# Altium schematic sheet Magnetometer_Analog.SchDoc
size Tabloid
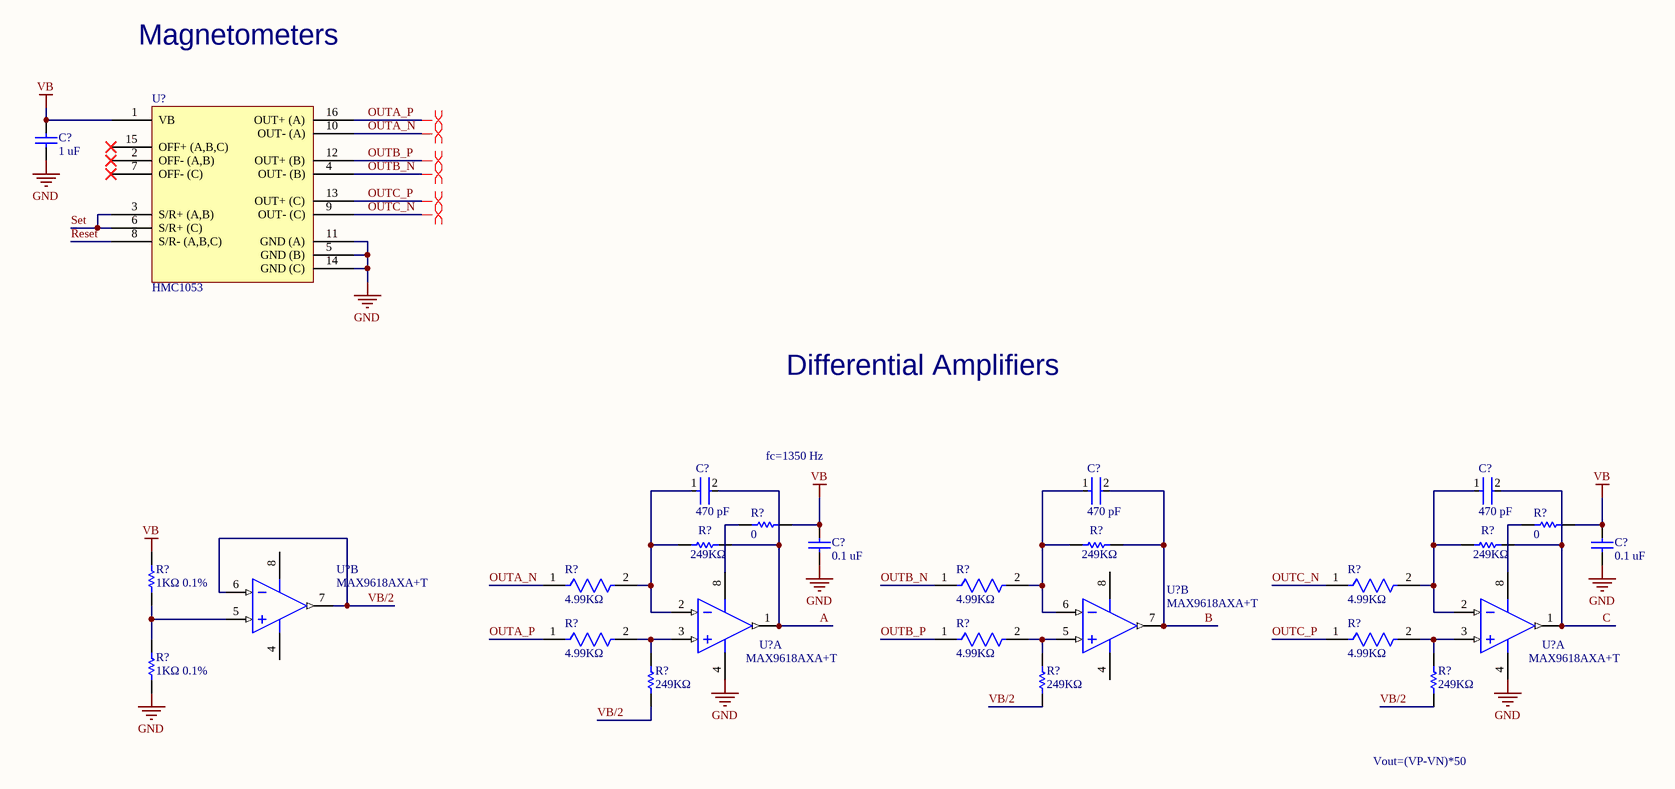
[diagram p0: Magnetometer_Analog.SchDoc]

## Parts
(Parts that share a designator on the sheet are numbered #1, #2 ... from top to bottom, then left to right.)
C?#1  1 uF  [CAPC1608X90X20ML10]
C?#2  470 pF  [FP-C0603C-CF-MFG]
C?#3  470 pF  [FP-C0603C-CF-MFG]
C?#4  470 pF  [FP-C0603C-CF-MFG]
C?#5  0.1 uF  [CAPC1608X87X35NL15T15]
C?#6  0.1 uF  [CAPC1608X87X35NL15T15]
R?#1  0  [RESC1608X55X25NL10T15]
R?#2  0  [RESC1608X55X25NL10T15]
R?#3  249KΩ  [RESC1609X55X30NL10T20]
R?#4  249KΩ  [RESC1609X55X30NL10T20]
R?#5  249KΩ  [RESC1609X55X30NL10T20]
R?#6  4.99KΩ  [FP-RT0603-MFG]
R?#7  4.99KΩ  [FP-RT0603-IPC_B]
R?#8  4.99KΩ  [FP-RT0603-IPC_B]
R?#9  1KΩ 0.1%  [RESC1608X55X30LL20T20]
R?#10  4.99KΩ  [FP-RT0603-IPC_B]
R?#11  4.99KΩ  [FP-RT0603-IPC_B]
R?#12  4.99KΩ  [FP-RT0603-IPC_B]
R?#13  1KΩ 0.1%  [RESC1608X55X30LL20T20]
R?#14  249KΩ  [RESC1609X55X30NL10T20]
R?#15  249KΩ  [RESC1609X55X30NL10T20]
R?#16  249KΩ  [RESC1609X55X30NL10T20]
U?#1  HMC1053  [LCC16]
U?#2  MAX9618AXA+T  [X8CN+1_L]  (part B of 2)
U?#3  MAX9618AXA+T  [X8CN+1_L]  (part A of 2)
U?#4  MAX9618AXA+T  [X8CN+1_L]  (part B of 2)
U?#5  MAX9618AXA+T  [X8CN+1_L]  (part A of 2)

## Nets
GND: C?#1.2 C?#5.1 C?#6.1 R?#13.1 U?#1.5(GND_(B)) U?#1.11(GND_(A)) U?#1.14(GND_(C)) U?#3.4(GND) U?#5.4(GND)
VB: C?#1.1 C?#5.2 C?#6.2 R?#1.2 R?#2.2 R?#9.2 U?#1.1(VB)
A: C?#2.2 R?#3.2 U?#3.1(OUT)
B: C?#3.2 R?#4.2 U?#4.7(OUT)
C: C?#4.2 R?#5.2 U?#5.1(OUT)
OUTA_N: R?#6.1 U?#1.10(OUT-_(A))
OUTA_P: R?#10.1 U?#1.16(OUT+_(A))
OUTB_N: R?#7.1 U?#1.4(OUT-_(B))
OUTB_P: R?#11.1 U?#1.12(OUT+_(B))
OUTC_N: R?#8.1 U?#1.9(OUT-_(C))
OUTC_P: R?#12.1 U?#1.13(OUT+_(C))
Reset: U?#1.8(S/R-_(A,B,C))
Set: U?#1.3(S/R+_(A,B)) U?#1.6(S/R+_(C))
VB/2: R?#14.1 R?#15.1 R?#16.1 U?#2.6(IN-) U?#2.7(OUT)
NetC?#2_1: C?#2.1 R?#3.1 R?#6.2 U?#3.2(IN-)
NetC?#3_1: C?#3.1 R?#4.1 R?#7.2 U?#4.6(IN-)
NetC?#4_1: C?#4.1 R?#5.1 R?#8.2 U?#5.2(IN-)
NetR?#1_1: R?#1.1 U?#3.8(VDD)
NetR?#2_1: R?#2.1 U?#5.8(VDD)
NetR?#9_1: R?#9.1 R?#13.2 U?#2.5(IN+)
NetR?#10_2: R?#10.2 R?#14.2 U?#3.3(IN+)
NetR?#11_2: R?#11.2 R?#15.2 U?#4.5(IN+)
NetR?#12_2: R?#12.2 R?#16.2 U?#5.3(IN+)

Not connected (* = marked no-connect by the designer): U?#1 2(OFF-_(A,B))* 7(OFF-_(C))* 15(OFF+_(A,B,C))*; U?#2 4(GND) 8(VDD); U?#4 4(GND) 8(VDD)

## Layout directives
differential pair: OUTA_N, OUTA_P, OUTB_N, OUTB_P, OUTC_N, OUTC_P

## Notes on the sheet
- Magnetometers
- Differential Amplifiers
- fc=1350 Hz
- Vout=(VP-VN)*50
- Title
- Size
- Date
- Tabloid
- DCN
- Time
- Sheet
- of
- Revision
- Drawn
- 33-207 / 77 Mass. Ave.
- Cambridge, MA 02139
- File

## Library data of the parts
C?#1 = CMP-2000-06025-1: Chip Capacitor, 1 uF, +/- 10%, 50 V, -55 to 85 degC, 0603 (1608 Metric), RoHS, Tape and Reel; Manufacturer: TDK; PCN Part Number: MLCCPartNumberChange30/Nov/2012; Other Names: 445-7468-6; Online Catalog: CSeries,GeneralPurpose; Capacitance: 1µF; Product Training Modules: CSeriesGeneralApplicationsSEAT,CCV,andTVCLDesignToolsGuidetoReplacinganElectrolyticCapacitorwithanMLCC; Voltage - Rated: 50V; Design Resources: 20WNon-IsolatedBuckLEDDriverUsingPLLNK460KG; Temperature Coefficient: X5R; Series: C; Datasheet Version: 08/2016; Package Description: 2-Pin Surface Mount Device, Body 1.6 x 0.8 mm; Mounting Technology: SurfaceMount; Features: -; Size / Dimension: 0.063"Lx0.031"W(1.60mmx0.80mm); Lead Spacing: -; Operating Temperature: -55°C~85°C; Tolerance: ±10%; Height - Seated (Max): -; Mounting Type: SurfaceMount,MLCC; Ratings: -; Standard Package: 1; Applications: GeneralPurpose; Datasheet URL: https://product.tdk.com/info/en/catalog/datasheets/mlcc_commercial_general_en.pdf; Category: Capacitors; Lead Style: -; Packaging: Digi-Reel®; RoHS Information: RoHSCertificate-MLCC; Package / Case: 0603(1608Metric); Package Reference: 0603; Manufacturer URL: http://www.tdk.com/; Thickness (Max): 0.035"(0.90mm); Family: CeramicCapacitors
C?#2-C?#4 = CMP-03020-013615-1: CAP CER 470PF 50V X7R 0603; Manufacturer Part Number: C0603C471K5RACTU; Manufacturer: KEMET; Tolerance: 0.1; Temperature Coefficient: 30ppm/°C; Material: Ceramic; Automotive Grade: Grade 1; Capacitance: 470 pF; Temperature Characteristic: X7R; Mouser Description: Ceramic Capacitor, 470Pf, 50V, X7R, 10%, 0603, Full Reel; Height: 0.87mm; Temperature: -55°C to +125°C; RoHS: TRUE; Lead Free: Yes; Category: Cap; ComponentLink2URL: https://api.kemet.com/component-edge/download/datasheet/C0603C100J5GACAUTO.pdf; Device Class L3: Ceramic Capacitors; Temperature Range High: +125°C; Package: C0603C-CF; Automotive: Yes; Device Class L2: Capacitors; Device Class L1: Passive Components; Value: 470 pF; Digikey Description: CAP CER 470PF 50V X7R 0603; Temperature Range Low: -55°C; ComponentLink2Description: Datasheet; Voltage Rating: 50 V; Octopart: https://octopart.com/c0603c471k5ractu-kemet-89311
C?#5 C?#6 = CMP-2006-03300-1: Part Number: C0603X104K5RACTU; Manufacturer: Kemet; Parameter 1: *
R?#1 R?#2 = CMP-2100-03667-1: Chip Resistor, 0 Ohm, +/- 5%, 0.1 W, -55 to 155 degC, 0603 (1608 Metric), RoHS, Tape and Reel; Manufacturer: Yageo; Temperature Coefficient: 200ppm/degreesC; Voltage Rating: 50V; Power Rating: 100mW; Resistance: 0mOhm; Width: 0.8mm; Max Operating Temperature: 155degC; Tolerance: 5%; Package Reference: 0603; Height: 0.45mm; Depth: 0.8mm; Package Description: 2-Pin Surface Mount Device, Body 1.6 x 0.8 mm; Termination: SMD/SMT; Package Quantity: 5000; Case/Package: 0603; Case Code (Imperial): 0603; Radiation Hardening: No; Number of Pins: 2; Length: 1.6mm; Lead Free: LeadFree; Voltage Rating (DC): 50V; Military Standard: Not; Datasheet URL: http://www.yageo.com/NewPortal/yageodocoutput?fileName=/pdf/R-Chip/PYu-RC_Group_51_RoHS_L_5.pdf; Manufacturer URL: http://www.yageo.com/; Packaging: TapeandReel; Case Code (Metric): 1608; Min Operating Temperature: -55degC; Composition: ThickFilm; RoHSCompliant: true; Contact Plating: Tin; Datasheet Version: Rev. 5, 10/2016; REACH SVHC: NoSVHC
R?#3-R?#5 R?#14-R?#16 = CMP-2000-03736-1: Part Number: TNPW0603249KBEEA; Manufacturer: Vishay Dale; Resistance: 249KΩ
R?#6-R?#8 R?#10-R?#12 = CMP-03412-033519-1: RES SMD 4.99K OHM 0.1% 1/10W; Manufacturer Part Number: RT0603BRE074K99L; Manufacturer: Yageo; Power Rating: 0.1W; Voltage Rating: 75V; Temperature Coefficient: 50 ppm/°C; Tolerance: 0.001; Device Class L1: Passive Components; Resistance: 4.99KΩ; Package: RT0603; ComponentLink2URL: http://www.yageo.com/documents/recent/PYu-RT_1-to-0.01_RoHS_L_9.pdf; Temperature Range Low: -55°C; Temperature: -55°C to +155°C; Device Class L2: Resistors; Footprint Url: http://www.yageo.com/exep/pages/download/literatures/PYu-R_Mount_10.pdf; Digikey Description: RES SMD 4.99K OHM 0.1% 1/10W; Lead Free: Yes; Mouser Description: Res Thin Film 0603 4.99K Ohm 0.1% 1/10W ±50ppm/°C Molded SMD Paper T/R; Octopart: https://octopart.com/rt0603bre074k99l-yageo-1445653; ComponentLink2Description: Datasheet; Series: RT; Device Class L3: Chip SMD Resistors; Height: 0.55mm; Temperature Range High: +155°C; RoHS: TRUE; Composition: Thin Film; Value: 4.99KΩ; Category: Res; Automotive: No; Ipc Land Pattern Name: RESC16080X45
R?#9 R?#13 = CMP-2000-00873-1: Manufacturer: Panasonic; Part Number: ERA3AEB102V; Parameter 1: *
U?#1 = HMC1053: Manufacturer 1: Honeywell; Operating Supply Voltage: 3V; Output Type: Wheatstone Bridge; Sensing Method: Magnetoresistive; Axis: X, Y, Z; Nominal Supply Current: 500mA; Min Supply Voltage: 1.8V; Max Supply Voltage: 20V; Bandwidth: 5MHz; Supplier 1: Digi-Key; Manufacturer Part Number 1: HMC1053; Stock 1: 284; Pricing 1: 1=70.65000, 4=63.60000, 100=53.00010, 500=51.24000 (USD); RoHS: Yes; Case/Package: PLCC; Number of Pins: 16; Min Operating Temperature: -40°C; Max Operating Temperature: 125°C; Package Quantity: 66; Packaging: Tape and Reel; Length: 7.4mm; Height: 2.5mm; Width: 7.4mm; Radiation Hardening: No; ComponentLink1URL: https://datasheet.ciiva.com/15099/getdatasheetpartid-59250-15099355.pdf?src-supplier=Verical; ComponentLink1Description: https://datasheet.ciiva.com/15099/getdatasheetpartid-59250-15099355.pdf?src-supplier=Verical; ComponentLink2URL: https://datasheet.ciiva.com/2816/hmc-1051-1052-1053-data-sheet-2816521.pdf?src-supplier=Digi-Key; ComponentLink2Description: https://datasheet.ciiva.com/2816/hmc-1051-1052-1053-data-sheet-2816521.pdf?src-supplier=Digi-Key
U?#2-U?#5 = CMP-0252-00081-1: 1.5MHz, High-Efficiency Dual Op Amps with Zero-Drift and Rail to Rail IO, 8-Pin SC70, -40°C to +125°C, Pb-Free, Tape and Reel; ComponentLink2URL: http://datasheets.maxim-ic.com/en/ds/MAX9617-MAX9620.pdf; ComponentLink3URL: http://pdfserv.maxim-ic.com/package_dwgs/21-0460.PDF; ComponentLink2Description: Datasheet; ComponentLink1Description: Manufacturer URL; ComponentLink1URL: http://www.maxim-ic.com; DatasheetVersion: Rev 5, Jul-2011; PackageDescription: 8-Pin SC70 Package 0.5 mm Pitch (X8CN+1) - Pb-Free; Code_JEDEC: MO-203; PackageVersion: revB, 2009; PackageReference: X8CN+1; ComponentLink3Description: Package Specification